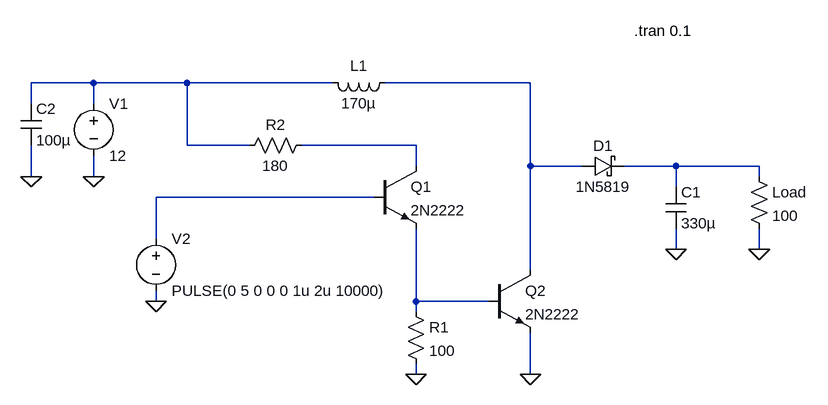
[diagram p0: schematic boostsimulation.asc]
boostsimulation.asc, the LTspice schematic file:
Version 4
SHEET 1 880 680
WIRE -384 -48 -480 -48
WIRE -240 -48 -384 -48
WIRE -16 -48 -240 -48
WIRE 288 -48 64 -48
WIRE -480 -16 -480 -48
WIRE -384 -16 -384 -48
WIRE -240 48 -240 -48
WIRE -144 48 -240 48
WIRE 112 48 -64 48
WIRE 112 80 112 48
WIRE 288 80 288 -48
WIRE 368 80 288 80
WIRE 512 80 432 80
WIRE 640 80 512 80
WIRE -480 96 -480 48
WIRE -384 96 -384 64
WIRE 640 96 640 80
WIRE 512 112 512 80
WIRE 48 128 -288 128
WIRE -288 192 -288 128
WIRE 512 208 512 176
WIRE 640 208 640 176
WIRE 288 240 288 80
WIRE -288 288 -288 272
WIRE 112 288 112 176
WIRE 224 288 112 288
WIRE 112 304 112 288
WIRE 112 400 112 384
WIRE 288 400 288 336
FLAG 512 208 0
FLAG 288 400 0
FLAG 112 400 0
FLAG -384 96 0
FLAG -480 96 0
FLAG -288 288 0
FLAG 640 208 0
SYMBOL npn 48 80 R0
SYMATTR InstName Q1
SYMATTR Value 2N2222
SYMBOL npn 224 240 R0
SYMATTR InstName Q2
SYMATTR Value 2N2222
SYMBOL res 96 288 R0
SYMATTR InstName R1
SYMATTR Value 100
SYMBOL ind 80 -64 R90
WINDOW 0 5 56 VBottom 2
WINDOW 3 32 56 VTop 2
SYMATTR InstName L1
SYMATTR Value 170µ
SYMBOL res -48 32 R90
WINDOW 0 0 56 VBottom 2
WINDOW 3 32 56 VTop 2
SYMATTR InstName R2
SYMATTR Value 180
SYMBOL schottky 368 96 R270
WINDOW 0 32 32 VTop 2
WINDOW 3 0 32 VBottom 2
SYMATTR InstName D1
SYMATTR Value 1N5819
SYMBOL cap 496 112 R0
SYMATTR InstName C1
SYMATTR Value 330µ
SYMBOL voltage -384 -32 R0
WINDOW 123 0 0 Left 0
WINDOW 39 0 0 Left 0
SYMATTR InstName V1
SYMATTR Value 12
SYMBOL cap -496 -16 R0
SYMATTR InstName C2
SYMATTR Value 100µ
SYMBOL voltage -288 176 R0
WINDOW 123 0 0 Left 0
WINDOW 39 0 0 Left 0
SYMATTR InstName V2
SYMATTR Value PULSE(0 5 0 0 0 1u 2u 10000)
SYMBOL res 624 80 R0
SYMATTR InstName Load
SYMATTR Value 100
TEXT 448 -128 Left 2 !.tran 0.1

The netlist it stands for:
* boostsimulation.asc
Q1 N003 N005 N006 0 2N2222
Q2 N002 N006 0 0 2N2222
R1 N006 0 100
L1 N002 N001 170µ
R2 N003 N001 180
D1 N002 N004 1N5819
C1 N004 0 330µ
V1 N001 0 12
C2 N001 0 100µ
V2 N005 0 PULSE(0 5 0 0 0 1u 2u 10000)
R§Load N004 0 100
.model D D
.lib standard.dio
.model NPN NPN
.model PNP PNP
.lib standard.bjt
.tran 0.1
.backanno
.end